# EAGLE design gpio8s5 (EAGLE 7.2.0)
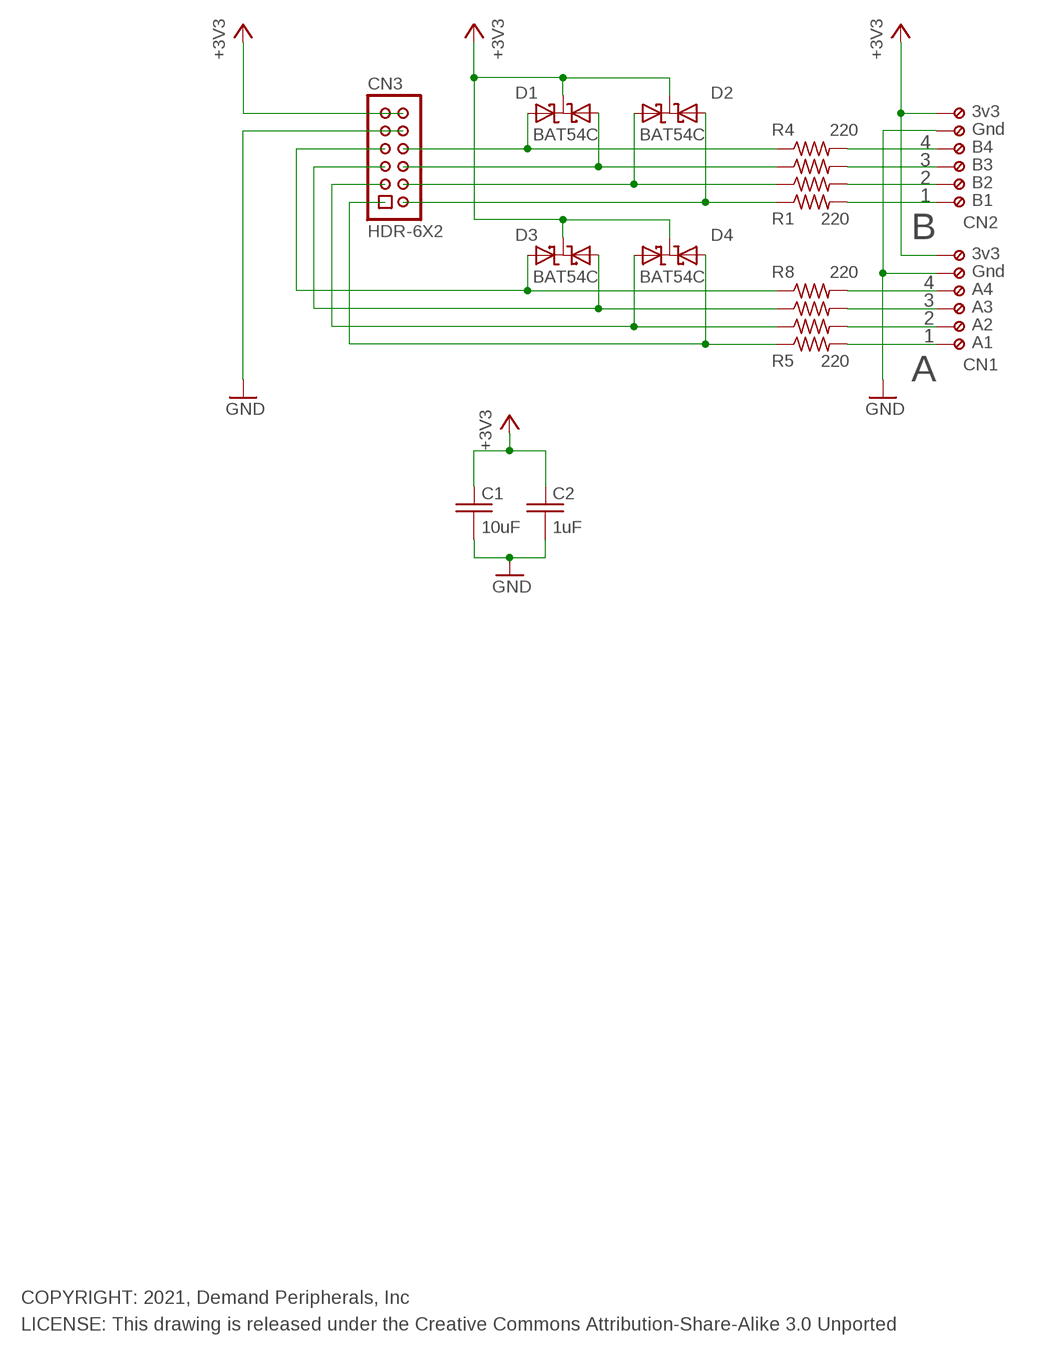
[diagram p0: schematic, sheet 1]

## Parts
C1  10uF  C10UF25V_C1206  [C1206]
C2  1uF  C1.0UF_C0603  [C0603]
CN1  TBLK-3.5X6  [TBLK-3.5X6]
CN2  TBLK-3.5X6  [TBLK-3.5X6]
CN3  HDR-6X2  [HDR-6X2]
D1  BAT54C  [SOT23]
D2  BAT54C  [SOT23]
D3  BAT54C  [SOT23]
D4  BAT54C  [SOT23]
R1  220  R220_R0603  [R0603]
R2  220  R220_R0603  [R0603]
R3  220  R220_R0603  [R0603]
R4  220  R220_R0603  [R0603]
R5  220  R220_R0603  [R0603]
R6  220  R220_R0603  [R0603]
R7  220  R220_R0603  [R0603]
R8  220  R220_R0603  [R0603]

## Nets
+3V3: C1.1 C2.1 CN1.1(KL) CN2.1(KL) CN3.11 CN3.12 D1.3(CC) D2.3(CC) D3.3(CC) D4.3(CC)
GND: C1.2 C2.2 CN1.2(KL1) CN2.2(KL1) CN3.9 CN3.10
N$1: CN2.3(KL2) R4.2
N$2: CN2.4(KL3) R3.2
N$3: CN2.5(KL4) R2.2
N$4: CN2.6(KL5) R1.2
N$5: CN3.7 D3.1(A1) R8.1
N$6: CN3.5 D3.2(A) R7.1
N$7: CN3.3 D4.1(A1) R6.1
N$8: CN3.1 D4.2(A) R5.1
N$9: CN1.3(KL2) R8.2
N$10: CN1.4(KL3) R7.2
N$11: CN3.8 D1.1(A1) R4.1
N$12: CN3.6 D1.2(A) R3.1
N$13: CN1.5(KL4) R6.2
N$14: CN3.4 D2.1(A1) R2.1
N$15: CN3.2 D2.2(A) R1.1
N$16: CN1.6(KL5) R5.2

## Notes on the sheet
- 3v3
- Gnd
- 4 | B4
- 3 | B3
- 2 | B2
- 1 | B1
- B
- 3v3
- Gnd
- 4
- A4
- 3
- A3
- 2
- A2
- 1
- A1
- A
- COPYRIGHT: 2021, Demand Peripherals, Inc
- LICENSE: This drawing is released under the Creative Commons Attribution-Share-Alike 3.0 Unported

## Library data of the parts
C1 = dpi-passive:C10UF25V_: 10 uF Capacitor, 25V, X7R; VENDOR: Digikey; VENDOR-PART-NUM: 1276-1804-2-ND
C2 = dpi-passive:C1.0UF_: 1.0 uF Capacitor, 25V, Y5V; VENDOR: Digikey; VENDOR-PART-NUM: 490-3897-2-ND
CN1 CN2 = dpi-conn:TBLK-3.5X6: Terminal block, 3.5mm, 6 position; VENDOR: Digikey; VENDOR-PART-NUM: ED2744-ND
CN3 = dpi-conn:HDR-6X2: Right angle 6x2 header
D1-D4 = dpi-diopto:BAT54C: BAT54C Dual Common Cathode Schottky; VENDOR: Digikey; VENDOR-PART-NUM: DB3X313N0LCT-ND
R1-R8 = dpi-passive:R220_: 220 Ohm resistor, 1%, 0.1 watt; VENDOR: Digikey; VENDOR-PART-NUM: 311-220HRTR-ND

## Board
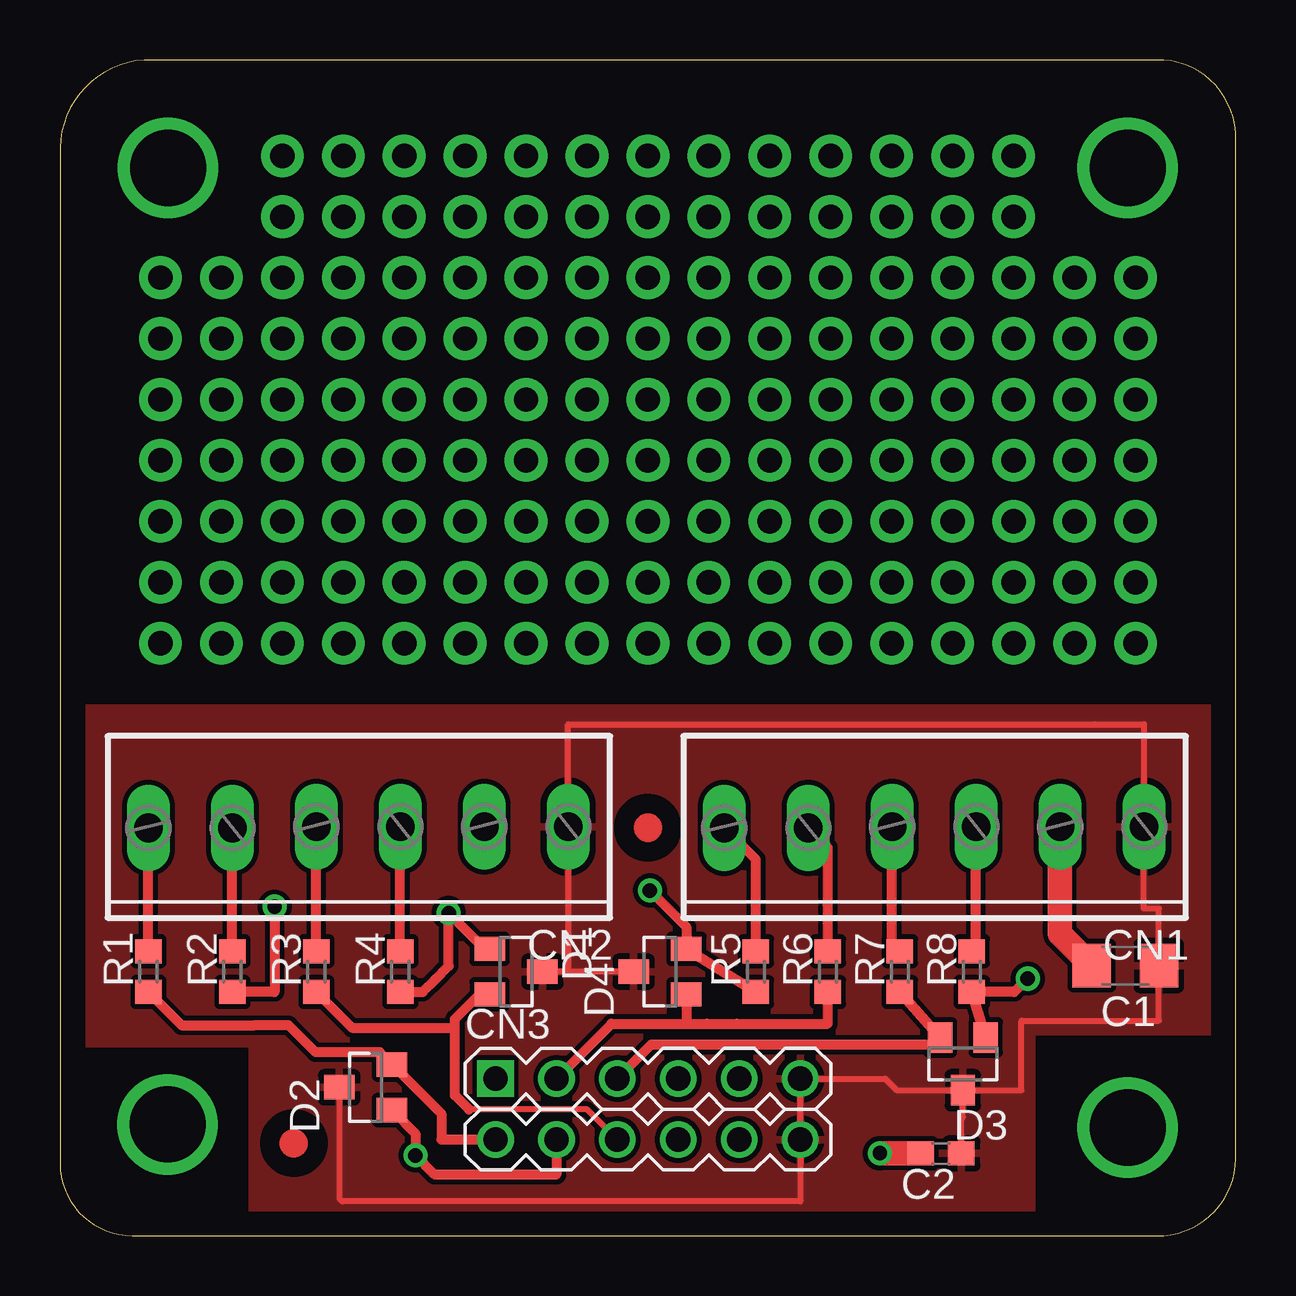
[diagram p1: board, top side]
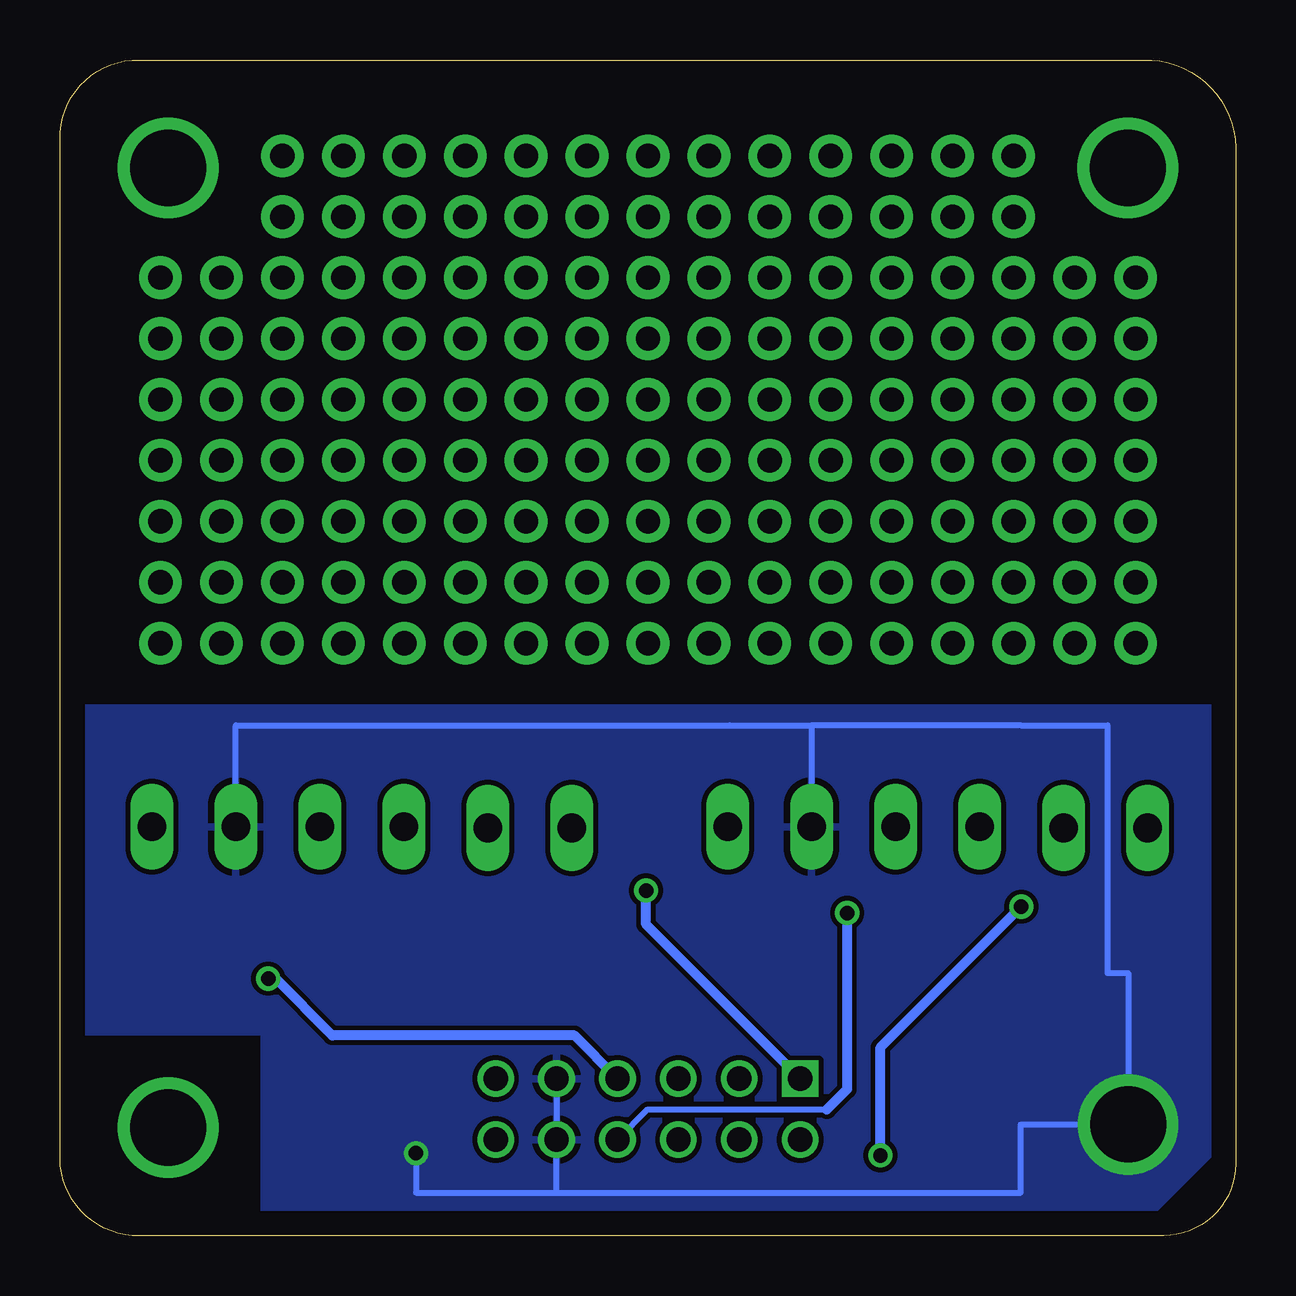
[diagram p2: board, bottom side, seen from below]

Size 49.02 x 49 mm. Coordinates in mm from the lower left corner, seen from the top.
Outline: 49.01,45.5 arc9 49.01,46
Outline: 49.01,46 arc81 46.01,49 3.51,49 arc90 0.01,45 0.01,3 arc90 3.01,0 46.01,0 arc90 49.01,3.5 49.01,46
Copper layers (1*16): Top 0.035mm / dielectric 1.5mm / Bottom 0.035mm
Design rules "default": minimum track width 10mil, minimum drill 10mil, track to track 8mil, track to pad 8mil, pad to pad 8mil, via to via 8mil, smd to smd 8mil, copper to edge 40mil, drill to drill 8mil, minimum pad ring 10mil, minimum via ring 8mil, stop-mask expansion 4mil, vias tented up to drill 0mil, thermal gap 10mil

### Footprints (pad centres in the part's own frame; a part is rotated, then mirrored left to right if it is on the bottom)
C1206 = smd 1.6 x 1.8: 1 -1.4,0; 2 1.4,0
C0603 = smd 1.1 x 1: 1 -0.85,0; 2 0.85,0
TBLK-3.5X6 = drill 1.2 long: 1 -8.68,-0.04; 2 -5.18,-0.04; 3 -1.68,-0.04; 4 1.82,-0.04; 5 5.32,0.01; 6 8.82,0.01
HDR-6X2 = drill 1.016 square: 1 1.27,6.35 | drill 1.016: 2 -1.27,6.35; 3 1.27,3.81; 4 -1.27,3.81; 5 1.27,1.27; 6 -1.27,1.27; 7 1.27,-1.27; 8 -1.27,-1.27; 9 1.27,-3.81; 10 -1.27,-3.81; 11 1.27,-6.35; 12 -1.27,-6.35
SOT23 = smd 1.016 x 1.27: 1 -0.95,-1.1; 2 0.95,-1.1; 3 0,1.1
R0603 = smd 1 x 1.1: 1 -0.85,0; 2 0.85,0

### Placement (x,y rotation side)
C1  44.41,11.25 180 top
C2  36.72,3.42 180 top
CN1  36.51,17 180 top
CN2  12.51,17 180 top
CN3  24.51,5.27 90 top
D1  19.01,11 270 top
D2  12.74,6.18 90 top
D3  37.64,7.16 180 top
D4  25.01,11 90 top
R1  3.69,11 90 top
R2  7.19,11 90 top
R3  10.69,11 90 top
R4  14.19,11 90 top
R5  29.01,11 90 top
R6  32.01,11 90 top
R7  35.01,11 90 top
R8  38.01,11 90 top
U$2  DP_FRAME_P  [P_FRAME]  -2.53,-2.54 0 top
U$3  [FIDUCIAL]  9.75,3.85 0 top
U$8  [FIDUCIAL]  24.51,17 0 top

### Tracks (layer width: path | path; a pad name or v marks a point on that pad's centre or on a via)
+3V3
  Top 0.254: D3.3 34.88,6.06 34.78,6.16 34.4,6.54 CN3.11 CN3.12 30.86,1.42 11.77,1.42 11.64,1.55 D2.3 | C2.1 37.57,4.86 37.63,4.92 37.64,4.93 D3.3 | D3.3 40.08,6.06 40.08,8.95 45.81,8.95 C1.1 45.81,13.62 45.58,13.62 45.19,13.62 CN1.1 45.19,21.31 43.15,21.31 21.19,21.31 CN2.1 21.19,11 21.43,11 | D4.3 21.43,11 | 21.43,11 D1.3
  pour Top: 1.01,22 48.01,22 48.01,8.5 40.51,8.5 40.51,1 8.01,1 8.01,8 1.01,8
GND  (via drill 0.6, 3.17)
  Top 1.016: C1.2 41.69,12.57 CN1.2 | C2.2 v34.18,3.42 v34.18,3.43
  Bottom 0.254: CN1.2 41.69,21.27 21.11,21.27 17.69,21.27 | 17.69,21.27 CN2.2 | v34.18,3.43 34.18,1.79 28.32,1.79 | 28.32,1.79 8.97,1.79 8.97,4.63 v4.49,4.63 4.49,10.94 5.36,10.94 5.36,21.27 8.97,21.27 17.69,21.27 | 28.32,1.79 CN3.10 CN3.9
  pour Bottom: 1.01,3.5 1.01,22 48.01,22 48.01,8.5 40.51,8.5 40.51,1 3.51,1
MOUNT1  (via drill 3.17 pad 3.17)
  other vias: 44.51,44.5
N$1
  Top 0.406: R4.2 CN2.3
N$2
  Top 0.406: R3.2 CN2.4
N$3
  Top 0.406: R2.2 CN2.5
N$4
  Top 0.406: R1.2 CN2.6
N$5  (via drill 0.6)
  Top 0.406: D3.1 R8.1 39.78,10.15 v40.34,10.71
  Bottom 0.406: CN3.7 27.58,8.34 37.67,8.34 40.04,10.71 v40.34,10.71
N$6
  Top 0.406: R7.1 D3.2 36.38,7.95 24.64,7.95 CN3.5
N$7
  Top 0.406: 26.96,8.83 26.1,8.83 26.11,8.83 D4.1 | 26.96,8.83 28.22,8.83 32.01,8.83 R6.1 | CN3.3 22.99,8.83 26.96,8.83
N$8  (via drill 0.6)
  Top 0.406: R5.1 D4.2 26.11,12.86 v24.59,14.38
  Bottom 0.406: CN3.1 24.59,12.97 v24.59,14.38
N$9
  Top 0.406: R8.2 38.19,12.03 CN1.3
N$10
  Top 0.406: R7.2 34.69,12.17 CN1.4
N$11  (via drill 0.6)
  Top 0.406: D1.1 17.7,11.95 v16.2,13.44 16.2,11.24 15.65,10.68 15.12,10.15 R4.1
  Bottom 0.254: CN3.8 24.52,5.26 17.41,5.26 17.05,5.26
  Bottom 0.406: v16.2,13.44 16.2,6.1 17.05,5.26
N$12
  Top 0.254: CN3.6 21.98,5.26 17.05,5.26
  Top 0.406: 17.05,5.26 16.47,5.84 16.47,8.66 | 16.47,8.66 16.47,9.03 17.49,10.05 D1.2 | R3.1 12.18,8.66 16.47,8.66
N$13
  Top 0.406: R6.2 32.01,16.17 CN1.5
N$14  (via drill 0.6)
  Top 0.406: CN3.4 20.7,2.54 15.86,2.54 15.62,2.54 v14.82,3.34 14.82,4.25 D2.1 | v8.95,13.71 8.95,10.15 R2.1
  Bottom 0.406: v14.82,3.34 14.82,7.84 v8.95,13.71
N$15
  Top 0.406: CN3.2 16.22,4 15.9,4 15.9,5.07 D2.2 13.33,7.64 10.66,7.64 9.53,8.77 8.12,8.77 5.07,8.77 R1.1
N$16
  Top 0.406: R5.2 29.01,15.67 CN1.6
N$17  (via drill 3.17 pad 3.17)
  other vias: 4.51,44.5
N$18  (via drill 3.17 pad 3.17)
  other vias: 44.51,4.5
WW1  (via drill 1.02 pad 1.78)
  other vias: 37.21,24.69
WW2  (via drill 1.02 pad 1.78)
  other vias: 37.21,29.77
WW3  (via drill 1.02 pad 1.78)
  other vias: 4.19,27.23
WW4  (via drill 1.02 pad 1.78)
  other vias: 4.19,24.69
WW5  (via drill 1.02 pad 1.78)
  other vias: 4.19,29.77
WW6  (via drill 1.02 pad 1.78)
  other vias: 4.19,32.31
WW7  (via drill 1.02 pad 1.78)
  other vias: 4.19,34.85
WW8  (via drill 1.02 pad 1.78)
  other vias: 4.19,37.39
WW9  (via drill 1.02 pad 1.78)
  other vias: 4.19,39.93
WW10  (via drill 1.02 pad 1.78)
  other vias: 39.75,24.69
WW11  (via drill 1.02 pad 1.78)
  other vias: 39.75,29.77
WW13  (via drill 1.02 pad 1.78)
  other vias: 6.73,27.23
WW14  (via drill 1.02 pad 1.78)
  other vias: 9.27,27.23
WW15  (via drill 1.02 pad 1.78)
  other vias: 11.81,27.23
WW16  (via drill 1.02 pad 1.78)
  other vias: 6.73,24.69
WW17  (via drill 1.02 pad 1.78)
  other vias: 6.73,29.77
WW18  (via drill 1.02 pad 1.78)
  other vias: 6.73,32.31
WW19  (via drill 1.02 pad 1.78)
  other vias: 6.73,34.85
WW20  (via drill 1.02 pad 1.78)
  other vias: 6.73,37.39
WW21  (via drill 1.02 pad 1.78)
  other vias: 6.73,39.93
WW22  (via drill 1.02 pad 1.78)
  other vias: 42.29,24.69
WW23  (via drill 1.02 pad 1.78)
  other vias: 42.29,29.77
WW24  (via drill 1.02 pad 1.78)
  other vias: 14.35,27.23
WW25  (via drill 1.02 pad 1.78)
  other vias: 16.89,27.23
WW26  (via drill 1.02 pad 1.78)
  other vias: 19.43,27.23
WW27  (via drill 1.02 pad 1.78)
  other vias: 21.97,27.23
WW28  (via drill 1.02 pad 1.78)
  other vias: 9.27,24.69
WW29  (via drill 1.02 pad 1.78)
  other vias: 9.27,29.77
WW30  (via drill 1.02 pad 1.78)
  other vias: 9.27,32.31
WW31  (via drill 1.02 pad 1.78)
  other vias: 9.27,34.85
WW32  (via drill 1.02 pad 1.78)
  other vias: 9.27,37.39
WW33  (via drill 1.02 pad 1.78)
  other vias: 9.27,39.93
WW34  (via drill 1.02 pad 1.78)
  other vias: 9.27,42.47
WW35  (via drill 1.02 pad 1.78)
  other vias: 9.27,45.01
WW36  (via drill 1.02 pad 1.78)
  other vias: 44.83,24.69
WW37  (via drill 1.02 pad 1.78)
  other vias: 24.51,27.23
WW38  (via drill 1.02 pad 1.78)
  other vias: 27.05,27.23
WW39  (via drill 1.02 pad 1.78)
  other vias: 29.59,27.23
WW40  (via drill 1.02 pad 1.78)
  other vias: 11.81,24.69
WW41  (via drill 1.02 pad 1.78)
  other vias: 11.81,29.77
WW42  (via drill 1.02 pad 1.78)
  other vias: 11.81,32.31
WW43  (via drill 1.02 pad 1.78)
  other vias: 11.81,34.85
WW44  (via drill 1.02 pad 1.78)
  other vias: 11.81,37.39
WW45  (via drill 1.02 pad 1.78)
  other vias: 11.81,39.93
WW47  (via drill 1.02 pad 1.78)
  other vias: 11.81,42.47
WW48  (via drill 1.02 pad 1.78)
  other vias: 44.83,29.77
WW49  (via drill 1.02 pad 1.78)
  other vias: 32.13,27.23
WW50  (via drill 1.02 pad 1.78)
  other vias: 11.81,45.01
WW51  (via drill 1.02 pad 1.78)
  other vias: 34.67,27.23
WW52  (via drill 1.02 pad 1.78)
  other vias: 14.35,24.69
WW53  (via drill 1.02 pad 1.78)
  other vias: 14.35,29.77
WW54  (via drill 1.02 pad 1.78)
  other vias: 14.35,32.31
WW55  (via drill 1.02 pad 1.78)
  other vias: 14.35,34.85
WW56  (via drill 1.02 pad 1.78)
  other vias: 14.35,37.39
WW57  (via drill 1.02 pad 1.78)
  other vias: 14.35,39.93
WW59  (via drill 1.02 pad 1.78)
  other vias: 14.35,42.47
WW60  (via drill 1.02 pad 1.78)
  other vias: 37.21,27.23
WW61  (via drill 1.02 pad 1.78)
  other vias: 14.35,45.01
WW62  (via drill 1.02 pad 1.78)
  other vias: 39.75,27.23
WW63  (via drill 1.02 pad 1.78)
  other vias: 42.29,27.23
WW64  (via drill 1.02 pad 1.78)
  other vias: 16.89,24.69
WW65  (via drill 1.02 pad 1.78)
  other vias: 16.89,29.77
WW66  (via drill 1.02 pad 1.78)
  other vias: 16.89,32.31
WW67  (via drill 1.02 pad 1.78)
  other vias: 16.89,34.85
WW68  (via drill 1.02 pad 1.78)
  other vias: 16.89,37.39
WW69  (via drill 1.02 pad 1.78)
  other vias: 16.89,39.93
WW71  (via drill 1.02 pad 1.78)
  other vias: 16.89,42.47
WW72  (via drill 1.02 pad 1.78)
  other vias: 16.89,45.01
WW73  (via drill 1.02 pad 1.78)
  other vias: 44.83,27.23
WW75  (via drill 1.02 pad 1.78)
  other vias: 19.43,42.47
WW76  (via drill 1.02 pad 1.78)
  other vias: 19.43,24.69
WW77  (via drill 1.02 pad 1.78)
  other vias: 19.43,29.77
WW78  (via drill 1.02 pad 1.78)
  other vias: 19.43,32.31
WW79  (via drill 1.02 pad 1.78)
  other vias: 19.43,34.85
WW80  (via drill 1.02 pad 1.78)
  other vias: 19.43,37.39
WW81  (via drill 1.02 pad 1.78)
  other vias: 19.43,39.93
WW82  (via drill 1.02 pad 1.78)
  other vias: 19.43,45.01
WW84  (via drill 1.02 pad 1.78)
  other vias: 21.97,42.47
WW85  (via drill 1.02 pad 1.78)
  other vias: 21.97,45.01
WW87  (via drill 1.02 pad 1.78)
  other vias: 24.51,42.47
WW88  (via drill 1.02 pad 1.78)
  other vias: 21.97,24.69
WW89  (via drill 1.02 pad 1.78)
  other vias: 21.97,29.77
WW90  (via drill 1.02 pad 1.78)
  other vias: 21.97,32.31
WW91  (via drill 1.02 pad 1.78)
  other vias: 21.97,34.85
WW92  (via drill 1.02 pad 1.78)
  other vias: 21.97,37.39
WW93  (via drill 1.02 pad 1.78)
  other vias: 21.97,39.93
WW94  (via drill 1.02 pad 1.78)
  other vias: 24.51,45.01
WW96  (via drill 1.02 pad 1.78)
  other vias: 27.05,42.47
WW97  (via drill 1.02 pad 1.78)
  other vias: 27.05,45.01
WW99  (via drill 1.02 pad 1.78)
  other vias: 29.59,42.47
WW100  (via drill 1.02 pad 1.78)
  other vias: 24.51,24.69
WW101  (via drill 1.02 pad 1.78)
  other vias: 24.51,29.77
WW102  (via drill 1.02 pad 1.78)
  other vias: 24.51,32.31
WW103  (via drill 1.02 pad 1.78)
  other vias: 24.51,34.85
WW104  (via drill 1.02 pad 1.78)
  other vias: 24.51,37.39
WW105  (via drill 1.02 pad 1.78)
  other vias: 24.51,39.93
WW106  (via drill 1.02 pad 1.78)
  other vias: 29.59,45.01
WW108  (via drill 1.02 pad 1.78)
  other vias: 32.13,42.47
WW109  (via drill 1.02 pad 1.78)
  other vias: 32.13,45.01
WW111  (via drill 1.02 pad 1.78)
  other vias: 34.67,42.47
WW112  (via drill 1.02 pad 1.78)
  other vias: 27.05,24.69
WW113  (via drill 1.02 pad 1.78)
  other vias: 27.05,29.77
WW114  (via drill 1.02 pad 1.78)
  other vias: 27.05,32.31
WW115  (via drill 1.02 pad 1.78)
  other vias: 27.05,34.85
WW116  (via drill 1.02 pad 1.78)
  other vias: 27.05,37.39
WW117  (via drill 1.02 pad 1.78)
  other vias: 27.05,39.93
WW118  (via drill 1.02 pad 1.78)
  other vias: 34.67,45.01
WW120  (via drill 1.02 pad 1.78)
  other vias: 37.21,42.47
WW121  (via drill 1.02 pad 1.78)
  other vias: 37.21,45.01
WW123  (via drill 1.02 pad 1.78)
  other vias: 39.75,42.47
WW124  (via drill 1.02 pad 1.78)
  other vias: 29.59,24.69
WW125  (via drill 1.02 pad 1.78)
  other vias: 29.59,29.77
WW126  (via drill 1.02 pad 1.78)
  other vias: 29.59,32.31
WW127  (via drill 1.02 pad 1.78)
  other vias: 29.59,34.85
WW128  (via drill 1.02 pad 1.78)
  other vias: 29.59,37.39
WW129  (via drill 1.02 pad 1.78)
  other vias: 29.59,39.93
WW130  (via drill 1.02 pad 1.78)
  other vias: 39.75,45.01
WW136  (via drill 1.02 pad 1.78)
  other vias: 32.13,24.69
WW137  (via drill 1.02 pad 1.78)
  other vias: 32.13,29.77
WW138  (via drill 1.02 pad 1.78)
  other vias: 32.13,32.31
WW139  (via drill 1.02 pad 1.78)
  other vias: 32.13,34.85
WW140  (via drill 1.02 pad 1.78)
  other vias: 32.13,37.39
WW141  (via drill 1.02 pad 1.78)
  other vias: 32.13,39.93
WW148  (via drill 1.02 pad 1.78)
  other vias: 34.67,24.69
WW149  (via drill 1.02 pad 1.78)
  other vias: 34.67,29.77
WW150  (via drill 1.02 pad 1.78)
  other vias: 34.67,32.31
WW151  (via drill 1.02 pad 1.78)
  other vias: 34.67,34.85
WW152  (via drill 1.02 pad 1.78)
  other vias: 34.67,37.39
WW153  (via drill 1.02 pad 1.78)
  other vias: 34.67,39.93
WW162  (via drill 1.02 pad 1.78)
  other vias: 37.21,32.31
WW163  (via drill 1.02 pad 1.78)
  other vias: 37.21,34.85
WW164  (via drill 1.02 pad 1.78)
  other vias: 37.21,37.39
WW165  (via drill 1.02 pad 1.78)
  other vias: 37.21,39.93
WW174  (via drill 1.02 pad 1.78)
  other vias: 39.75,32.31
WW175  (via drill 1.02 pad 1.78)
  other vias: 39.75,34.85
WW176  (via drill 1.02 pad 1.78)
  other vias: 39.75,37.39
WW177  (via drill 1.02 pad 1.78)
  other vias: 39.75,39.93
WW186  (via drill 1.02 pad 1.78)
  other vias: 42.29,32.31
WW187  (via drill 1.02 pad 1.78)
  other vias: 42.29,34.85
WW188  (via drill 1.02 pad 1.78)
  other vias: 42.29,37.39
WW189  (via drill 1.02 pad 1.78)
  other vias: 42.29,39.93
WW198  (via drill 1.02 pad 1.78)
  other vias: 44.83,32.31
WW199  (via drill 1.02 pad 1.78)
  other vias: 44.83,34.85
WW200  (via drill 1.02 pad 1.78)
  other vias: 44.83,37.39
WW201  (via drill 1.02 pad 1.78)
  other vias: 44.83,39.93

### Text on the board
tTest: 49 mm | 40 mm | GPIO8s5, Rev 21A | 40 mm | 49 mm | B | A | 1 | 2 | 3 | 4 | Gnd | 33 | 1 | 2 | 3 | 4 | Gnd | 33 | CN2 | CN1 | D4 | R1 | R2 | R3 | R4 | R5 | R6 | R7 | R8 | D1 | C1 | D2 | D3 | CN3 | C2 | (C) 2021, Demand Peripherals, Inc.